# EAGLE design ME6408_Flip_Clock (EAGLE 7.2.0)
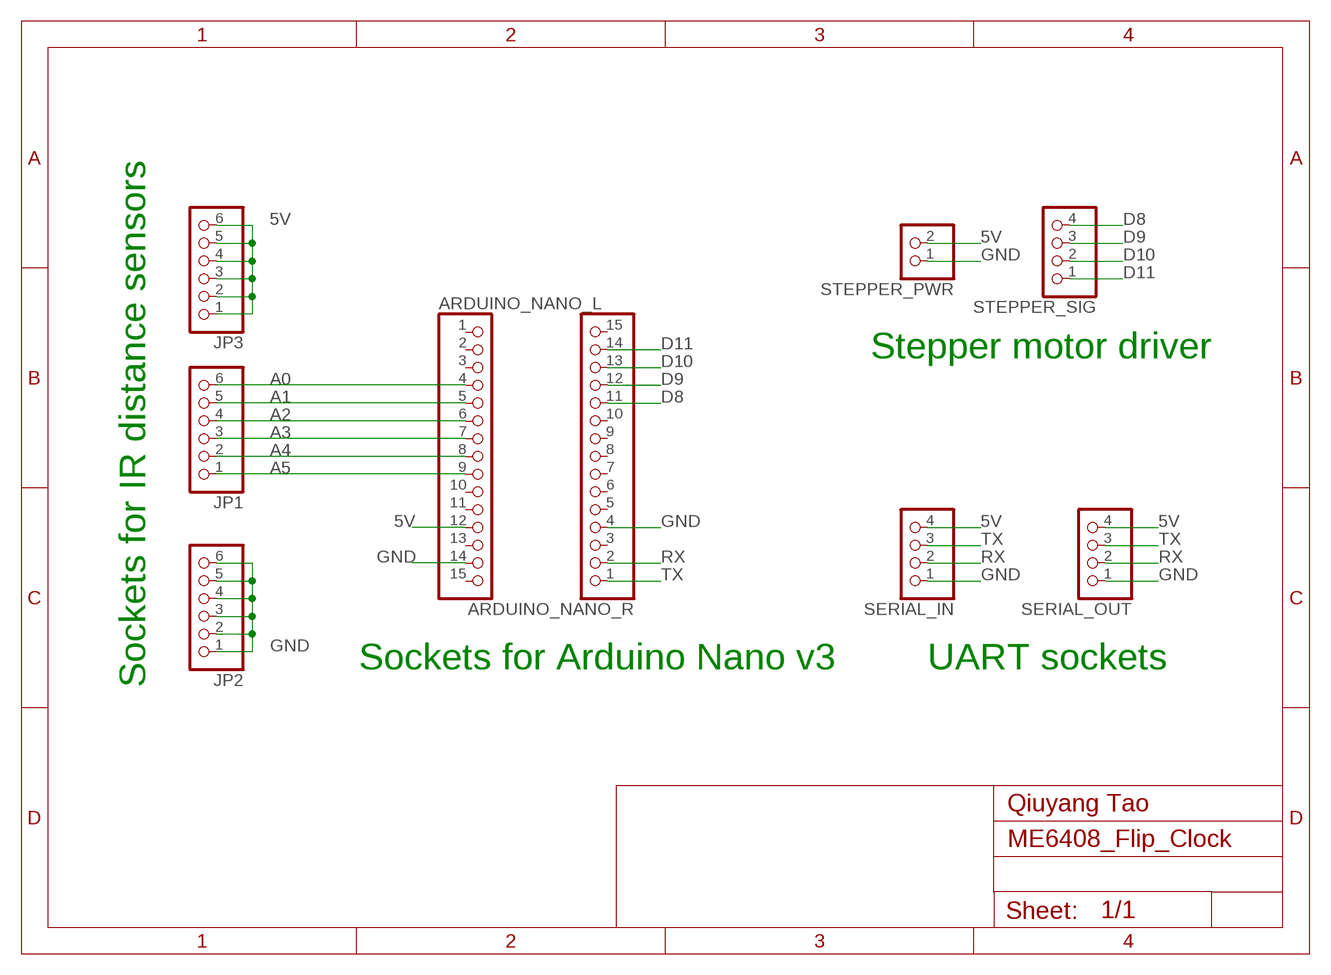
[diagram p0: schematic, sheet 1]

## Parts
ARDUINO_NANO_L  PINHD-1X15  [1X15]
ARDUINO_NANO_R  PINHD-1X15  [1X15]
JP1  PINHD-1X6  [1X06]
JP2  PINHD-1X6  [1X06]
JP3  PINHD-1X6  [1X06]
SERIAL_IN  PINHD-1X4  [1X04]
SERIAL_OUT  PINHD-1X4  [1X04]
STEPPER_PWR  PINHD-1X2  [1X02]
STEPPER_SIG  PINHD-1X4  [1X04]

## Nets
5V: ARDUINO_NANO_L.12 JP3.1 JP3.2 JP3.3 JP3.4 JP3.5 JP3.6 SERIAL_IN.4 SERIAL_OUT.4 STEPPER_PWR.2
A0: ARDUINO_NANO_L.4 JP1.6
A1: ARDUINO_NANO_L.5 JP1.5
A2: ARDUINO_NANO_L.6 JP1.4
A3: ARDUINO_NANO_L.7 JP1.3
A4: ARDUINO_NANO_L.8 JP1.2
A5: ARDUINO_NANO_L.9 JP1.1
D8: ARDUINO_NANO_R.11 STEPPER_SIG.4
D9: ARDUINO_NANO_R.12 STEPPER_SIG.3
D10: ARDUINO_NANO_R.13 STEPPER_SIG.2
D11: ARDUINO_NANO_R.14 STEPPER_SIG.1
GND: ARDUINO_NANO_L.14 ARDUINO_NANO_R.4 JP2.1 JP2.2 JP2.3 JP2.4 JP2.5 JP2.6 SERIAL_IN.1 SERIAL_OUT.1 STEPPER_PWR.1
RX: ARDUINO_NANO_R.2 SERIAL_IN.2 SERIAL_OUT.2
TX: ARDUINO_NANO_R.1 SERIAL_IN.3 SERIAL_OUT.3
Unconnected: ARDUINO_NANO_L.1 ARDUINO_NANO_L.2 ARDUINO_NANO_L.3 ARDUINO_NANO_L.10 ARDUINO_NANO_L.11 ARDUINO_NANO_L.13 ARDUINO_NANO_L.15 ARDUINO_NANO_R.3 ARDUINO_NANO_R.5 ARDUINO_NANO_R.6 ARDUINO_NANO_R.7 ARDUINO_NANO_R.8 ARDUINO_NANO_R.9 ARDUINO_NANO_R.10 ARDUINO_NANO_R.15

## Notes on the sheet
- Stepper motor driver
- Sockets for Arduino Nano v3 | UART sockets
- Sockets for IR distance sensors
- Qiuyang Tao

## Library data of the parts
ARDUINO_NANO_L ARDUINO_NANO_R = pinhead:PINHD-1X15: PIN HEADER
JP1-JP3 = pinhead:PINHD-1X6: PIN HEADER
SERIAL_IN SERIAL_OUT STEPPER_SIG = pinhead:PINHD-1X4: PIN HEADER
STEPPER_PWR = pinhead:PINHD-1X2: PIN HEADER

## Board
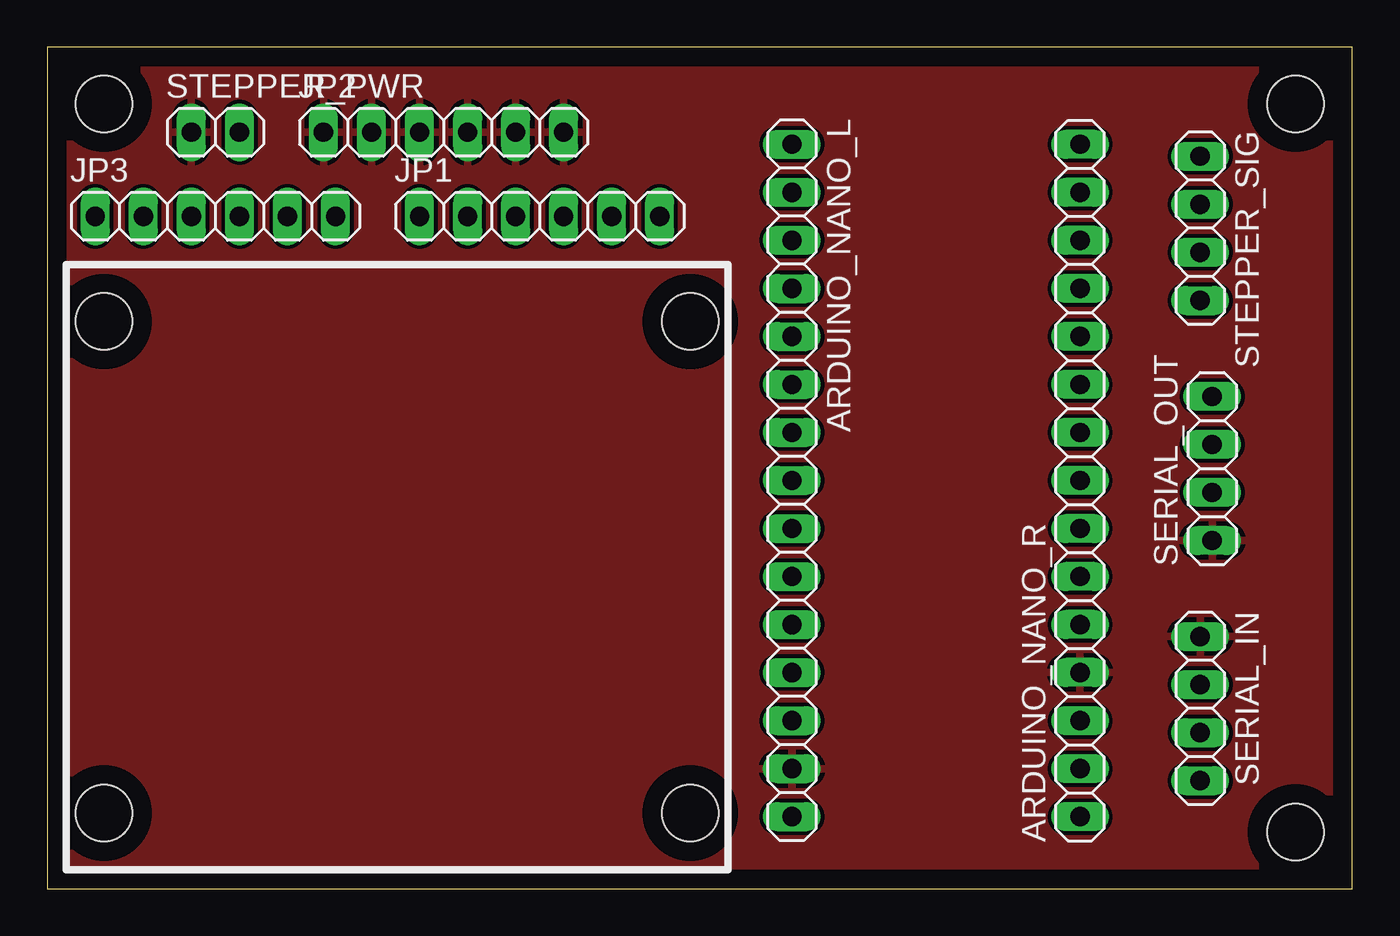
[diagram p1: board, top side]
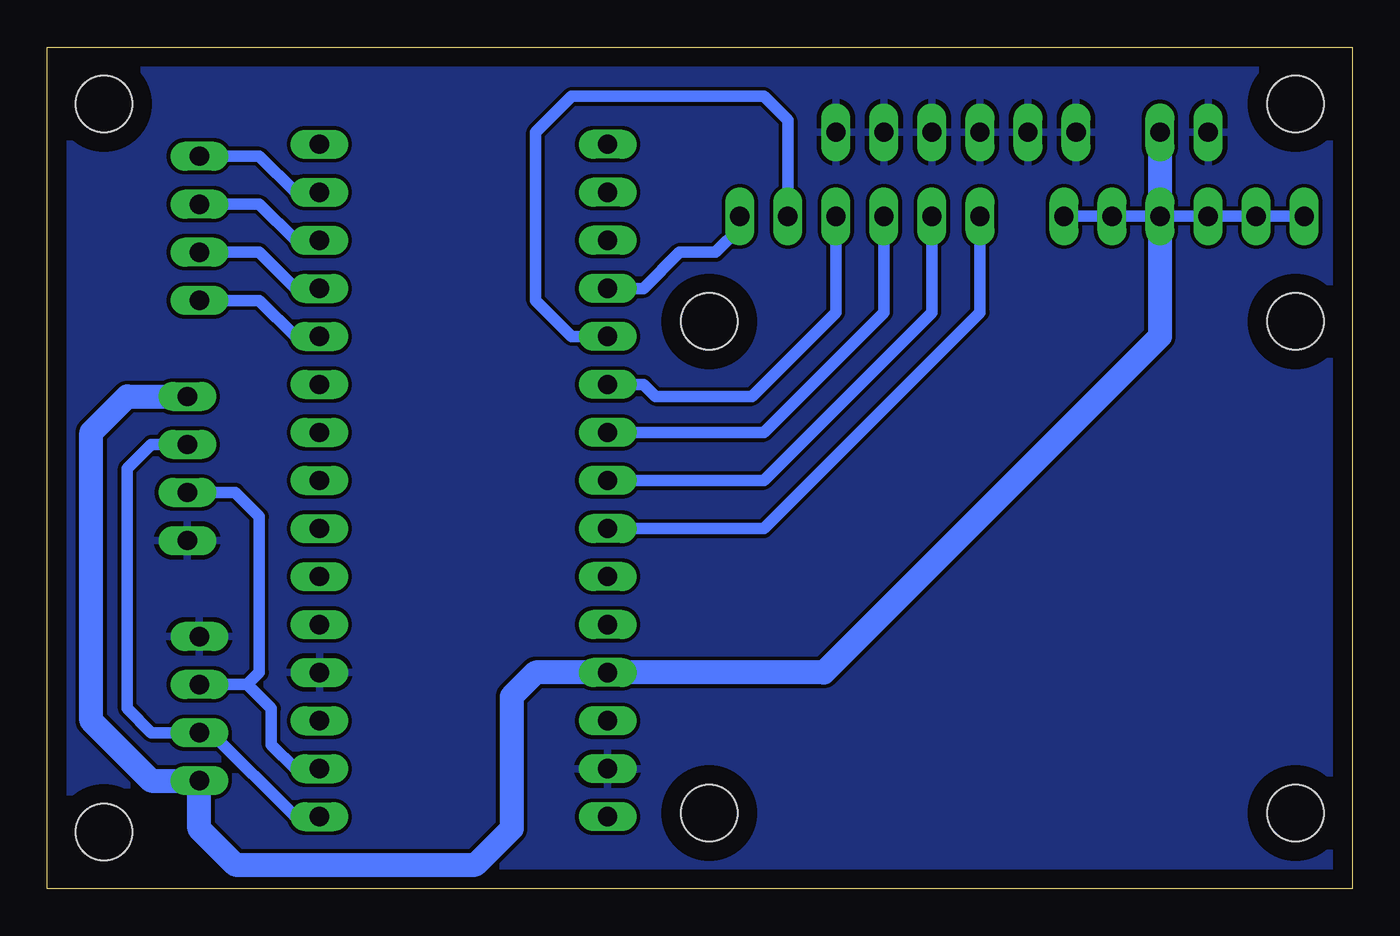
[diagram p2: board, bottom side, seen from below]

Size 69 x 44.5 mm. Coordinates in mm from the lower left corner, seen from the top.
Outline: 0,0 69,0 69,44.5 0,44.5 0,0
Copper layers (1*16): Top 0.035mm / dielectric 1.5mm / Bottom 0.035mm
Design rules "default": minimum track width 10mil, minimum drill 24mil, track to track 8mil, track to pad 8mil, pad to pad 8mil, via to via 8mil, smd to smd 8mil, copper to edge 40mil, drill to drill 8mil, minimum pad ring 10mil, minimum via ring 8mil, stop-mask expansion 4mil, vias tented up to drill 0mil, thermal gap 10mil
Holes 3 mm at 3,4 3,30 34,30 34,4 66,41.5 66,3 3,41.5

### Footprints (pad centres in the part's own frame; a part is rotated, then mirrored left to right if it is on the bottom)
1X15 = drill 1.016 long: 1 -17.78,0; 2 -15.24,0; 3 -12.7,0; 4 -10.16,0; 5 -7.62,0; 6 -5.08,0; 7 -2.54,0; 8 0,0; 9 2.54,0; 10 5.08,0; 11 7.62,0; 12 10.16,0; 13 12.7,0; 14 15.24,0; 15 17.78,0
1X06 = drill 1.016 long: 1 -6.35,0; 2 -3.81,0; 3 -1.27,0; 4 1.27,0; 5 3.81,0; 6 6.35,0
1X04 = drill 1.016 long: 1 -3.81,0; 2 -1.27,0; 3 1.27,0; 4 3.81,0
1X02 = drill 1.016 long: 1 -1.27,0; 2 1.27,0

### Placement (x,y rotation side)
ARDUINO_NANO_L  39.37,21.59 270 top
ARDUINO_NANO_R  54.61,21.59 90 top
JP1  26.04,35.56 0 top
JP2  20.95,40.01 0 top
JP3  8.89,35.56 0 top
SERIAL_IN  60.96,9.53 270 top
SERIAL_OUT  61.59,22.23 90 top
STEPPER_PWR  8.89,40.01 0 top
STEPPER_SIG  60.96,34.92 270 top

### Tracks (layer width: path | path; a pad name or v marks a point on that pad's centre or on a via)
5V
  Bottom 0.61: JP3.1 JP3.2 JP3.3 JP3.4 JP3.5 JP3.6
  Bottom 1.27: STEPPER_PWR.2 JP3.4 10.16,29.21 27.94,11.43 ARDUINO_NANO_L.12 43.18,11.43 44.45,10.16 44.45,3.17 46.35,1.27 59.05,1.27 60.96,3.17 SERIAL_IN.4 63.5,5.71 66.67,8.89 66.67,24.13 64.77,26.04 SERIAL_OUT.4
A0
  Bottom 0.61: ARDUINO_NANO_L.4 37.47,31.75 35.56,33.66 33.66,33.66 32.38,34.92 JP1.6
A1
  Bottom 0.61: ARDUINO_NANO_L.5 41.27,29.21 43.18,31.11 43.18,40.01 41.27,41.91 31.11,41.91 29.84,40.64 JP1.5
A2
  Bottom 0.61: JP1.4 27.3,30.48 31.75,26.04 36.83,26.04 37.47,26.67 ARDUINO_NANO_L.6
A3
  Bottom 0.61: ARDUINO_NANO_L.7 31.11,24.13 24.77,30.48 JP1.3
A4
  Bottom 0.61: ARDUINO_NANO_L.8 31.11,21.59 22.23,30.48 JP1.2
A5
  Bottom 0.61: ARDUINO_NANO_L.9 31.11,19.05 19.68,30.48 JP1.1
D8
  Bottom 0.61: ARDUINO_NANO_R.11 55.88,29.21 57.78,31.11 STEPPER_SIG.4
D9
  Bottom 0.61: ARDUINO_NANO_R.12 55.88,31.75 57.78,33.66 STEPPER_SIG.3
D10
  Bottom 0.61: ARDUINO_NANO_R.13 55.88,34.29 57.78,36.2 STEPPER_SIG.2
D11
  Bottom 0.61: ARDUINO_NANO_R.14 55.88,36.83 57.78,38.73 STEPPER_SIG.1
GND
  pour Bottom: -2,45 70,45 70,-2 -2,-2
  pour Top: -1,44 69,44 69,-1 -1,-1
RX
  Bottom 0.61: ARDUINO_NANO_R.2 55.88,6.35 57.15,7.62 57.15,9.53 58.42,10.79 | 58.42,10.79 SERIAL_IN.2 | 58.42,10.79 57.78,11.43 57.78,19.68 59.05,20.95 SERIAL_OUT.2
TX
  Bottom 0.61: ARDUINO_NANO_R.1 55.88,3.81 60.33,8.26 SERIAL_IN.3 | 62.23,8.26 SERIAL_IN.3 | SERIAL_IN.3 63.5,8.26 64.77,9.53 64.77,22.23 63.5,23.5 SERIAL_OUT.3